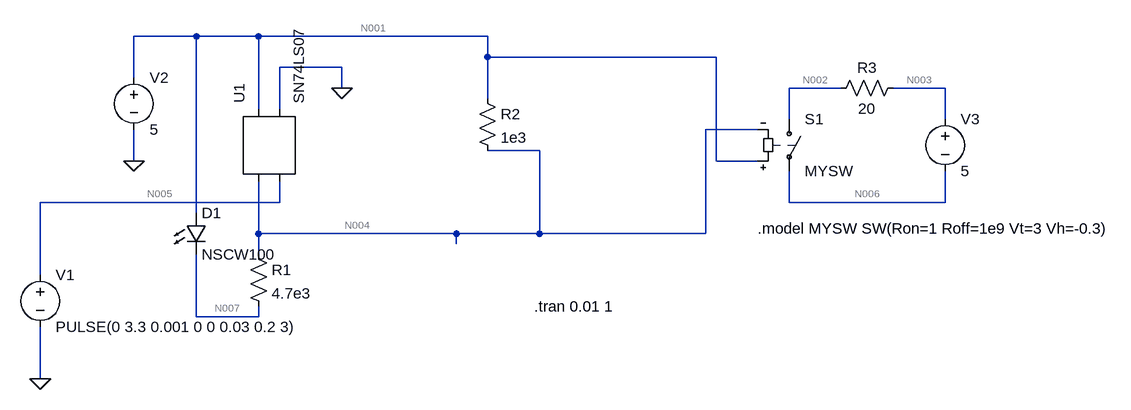
[diagram p0: schematic ttl_opencollector_driver.asc]
* ttl_opencollector_driver.asc
* U1: SN74LS07 (symbol AutoGenerated/SN74LS07 not available, pins judged from their places): pin1=N004 pin2=N005 pin3=N001 pin4=0
V1 N005 0 PULSE(0 3.3 0.001 0 0 0.03 0.2 3)
R1 N004 N007 4.7e3
V2 N001 0 5
R2 N001 N004 1e3
D1 N001 N007 NSCW100
S1 N002 N006 N001 N004 MYSW
V3 N003 N006 5
R3 N003 N002 20
.model D D
.lib standard.dio
.tran 0.01 1
.model MYSW SW(Ron=1 Roff=1e9 Vt=3 Vh=-0.3)
.backanno
.end

* Results of the author's LTspice run, read from the files saved beside the schematic
* Operating Point, zero values left out:
*   V(n001) = 5 V
*   V(n004) = 275.6 mV
*   V(n007) = 2.452 V
*   V(n002) = 238.1 mV
*   V(n006) = -1.322 µV
*   V(n003) = 5 V
*   I(D1) = 463 µA
*   I(R3) = 238.1 mA
*   I(R2) = 4.724 mA
*   I(R1) = -463 µA
*   I(S1) = -238.1 mA
*   I(V3) = -238.1 mA
*   I(V2) = -5.207 mA
*   Ix(u1:Y) = 5.187 mA
*   Ix(u1:VCC) = 19.86 µA
*   Ix(u1:AGND) = -5.207 mA
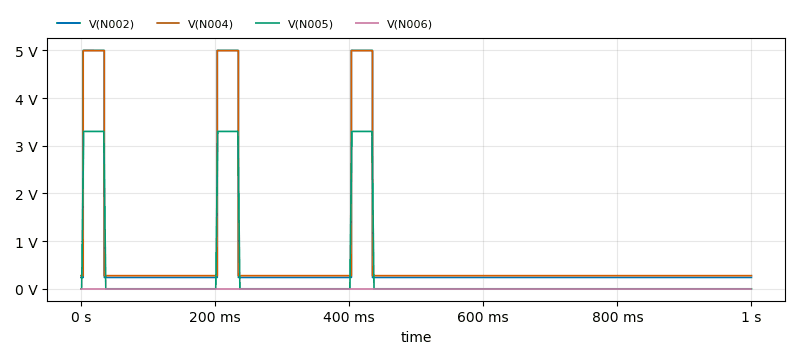
[diagram p1: Transient Analysis of ttl_opencollector_driver.asc, plotted from the saved traces]
* Transient Analysis, 1 run:
*   V(N002): min 238 mV, max 5 V, average 687.4 mV, rms 1.553 V, last 238.1 mV
*   V(N004): min 275.6 mV, max 4.995 V, average 720.9 mV, rms 1.557 V, last 275.6 mV
*   V(N005): min 0 V, max 3.3 V, average 326.7 mV, rms 1.023 V, last 0 V
*   V(N006): min -1.322 µV, max 13.98 µV, average 122.1 nV, rms 4.474 µV, last -1.322 µV